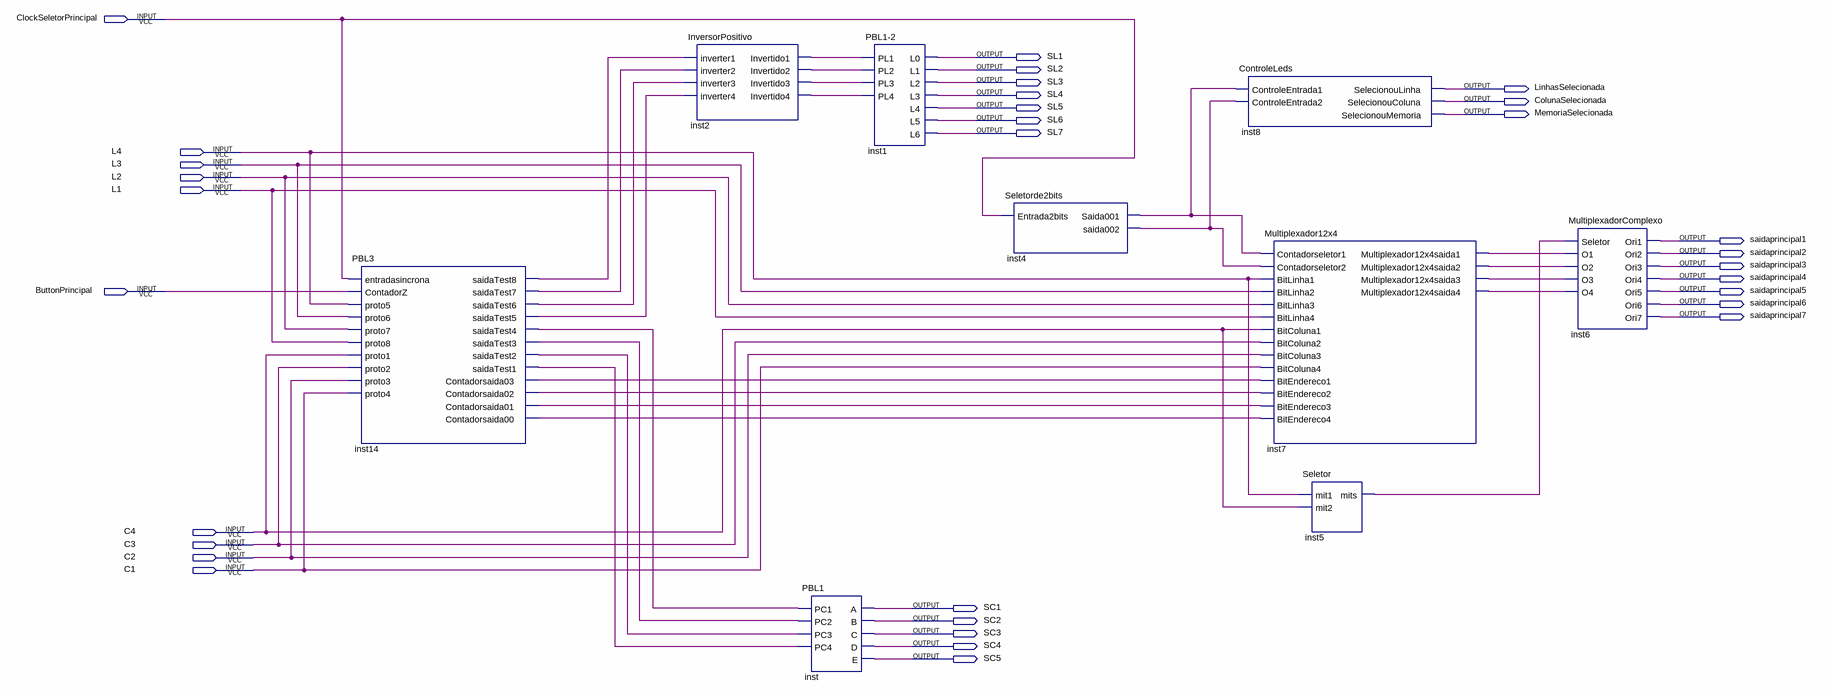
[diagram p0: schematic sheet]
// Quartus schematic CircuitoDigital.bdf as structural Verilog: 9 symbols, 32 pins
module CircuitoDigital (
  input  ClockSeletorPrincipal,
  input  L4,
  input  L3,
  input  L2,
  input  L1,
  input  ButtonPrincipal,
  input  C4,
  input  C3,
  input  C2,
  input  C1,
  output SL1,
  output SL2,
  output SL3,
  output LinhasSelecionada,
  output SL4,
  output ColunaSelecionada,
  output SL5,
  output MemoriaSelecionada,
  output SL6,
  output SL7,
  output saidaprincipal1,
  output saidaprincipal2,
  output saidaprincipal3,
  output saidaprincipal4,
  output saidaprincipal5,
  output saidaprincipal6,
  output saidaprincipal7,
  output SC1,
  output SC2,
  output SC3,
  output SC4,
  output SC5
);

  wire inst2_invertido1, inst2_invertido2, inst2_invertido3, inst2_invertido4, inst4_saida001,
       inst4_saida002, inst5_mits, inst7_multiplexador12x4saida1, inst7_multiplexador12x4saida2,
       inst7_multiplexador12x4saida3, inst7_multiplexador12x4saida4, inst14_contadorsaida00,
       inst14_contadorsaida01, inst14_contadorsaida02, inst14_contadorsaida03, inst14_saidatest1,
       inst14_saidatest2, inst14_saidatest3, inst14_saidatest4, inst14_saidatest5, inst14_saidatest6,
       inst14_saidatest7, inst14_saidatest8;

  PBL3 inst14 (
    .entradasincrona(ClockSeletorPrincipal), .ContadorZ(ButtonPrincipal), .proto5(L4), .proto6(L3),
    .proto7(L2), .proto8(L1), .proto1(C4), .proto2(C3), .proto3(C2), .proto4(C1),
    .Contadorsaida02(inst14_contadorsaida02), .Contadorsaida01(inst14_contadorsaida01),
    .Contadorsaida03(inst14_contadorsaida03), .Contadorsaida00(inst14_contadorsaida00),
    .saidaTest8(inst14_saidatest8), .saidaTest7(inst14_saidatest7), .saidaTest6(inst14_saidatest6),
    .saidaTest5(inst14_saidatest5), .saidaTest4(inst14_saidatest4), .saidaTest3(inst14_saidatest3),
    .saidaTest2(inst14_saidatest2), .saidaTest1(inst14_saidatest1));
  InversorPositivo inst2 (
    .inverter1(inst14_saidatest8), .inverter2(inst14_saidatest7), .inverter3(inst14_saidatest6),
    .inverter4(inst14_saidatest5), .Invertido1(inst2_invertido1), .Invertido2(inst2_invertido2),
    .Invertido3(inst2_invertido3), .Invertido4(inst2_invertido4));
  PBL1 inst (
    .PC1(inst14_saidatest4), .PC2(inst14_saidatest3), .PC3(inst14_saidatest2), .PC4(inst14_saidatest1),
    .A(SC1), .B(SC2), .C(SC3), .D(SC4), .E(SC5));
  \PBL1-2  inst1 (
    .PL1(inst2_invertido1), .PL2(inst2_invertido2), .PL3(inst2_invertido3), .PL4(inst2_invertido4), .L0(SL1),
    .L1(SL2), .L2(SL3), .L3(SL4), .L4(SL5), .L5(SL6), .L6(SL7));
  Seletorde2bits inst4 (.Entrada2bits(ClockSeletorPrincipal), .Saida001(inst4_saida001), .saida002(inst4_saida002));
  ControleLeds inst8 (
    .ControleEntrada1(inst4_saida001), .ControleEntrada2(inst4_saida002),
    .SelecionouLinha(LinhasSelecionada), .SelecionouColuna(ColunaSelecionada),
    .SelecionouMemoria(MemoriaSelecionada));
  Multiplexador12x4 inst7 (
    .Contadorseletor1(inst4_saida001), .Contadorseletor2(inst4_saida002), .BitLinha1(L4), .BitLinha2(L3),
    .BitLinha3(L2), .BitLinha4(L1), .BitColuna1(C4), .BitColuna2(C3), .BitColuna3(C2), .BitColuna4(C1),
    .BitEndereco1(inst14_contadorsaida03), .BitEndereco2(inst14_contadorsaida02),
    .BitEndereco3(inst14_contadorsaida01), .BitEndereco4(inst14_contadorsaida00),
    .Multiplexador12x4saida1(inst7_multiplexador12x4saida1),
    .Multiplexador12x4saida2(inst7_multiplexador12x4saida2),
    .Multiplexador12x4saida3(inst7_multiplexador12x4saida3),
    .Multiplexador12x4saida4(inst7_multiplexador12x4saida4));
  Seletor inst5 (.mit1(L4), .mit2(C4), .mits(inst5_mits));
  MultiplexadorComplexo inst6 (
    .Seletor(inst5_mits), .O1(inst7_multiplexador12x4saida1), .O2(inst7_multiplexador12x4saida2),
    .O3(inst7_multiplexador12x4saida3), .O4(inst7_multiplexador12x4saida4), .Ori7(saidaprincipal7),
    .Ori1(saidaprincipal1), .Ori2(saidaprincipal2), .Ori3(saidaprincipal3), .Ori4(saidaprincipal4),
    .Ori5(saidaprincipal5), .Ori6(saidaprincipal6));
endmodule
